# EasyEDA Pro project uChameleon.eprj, board PCB1
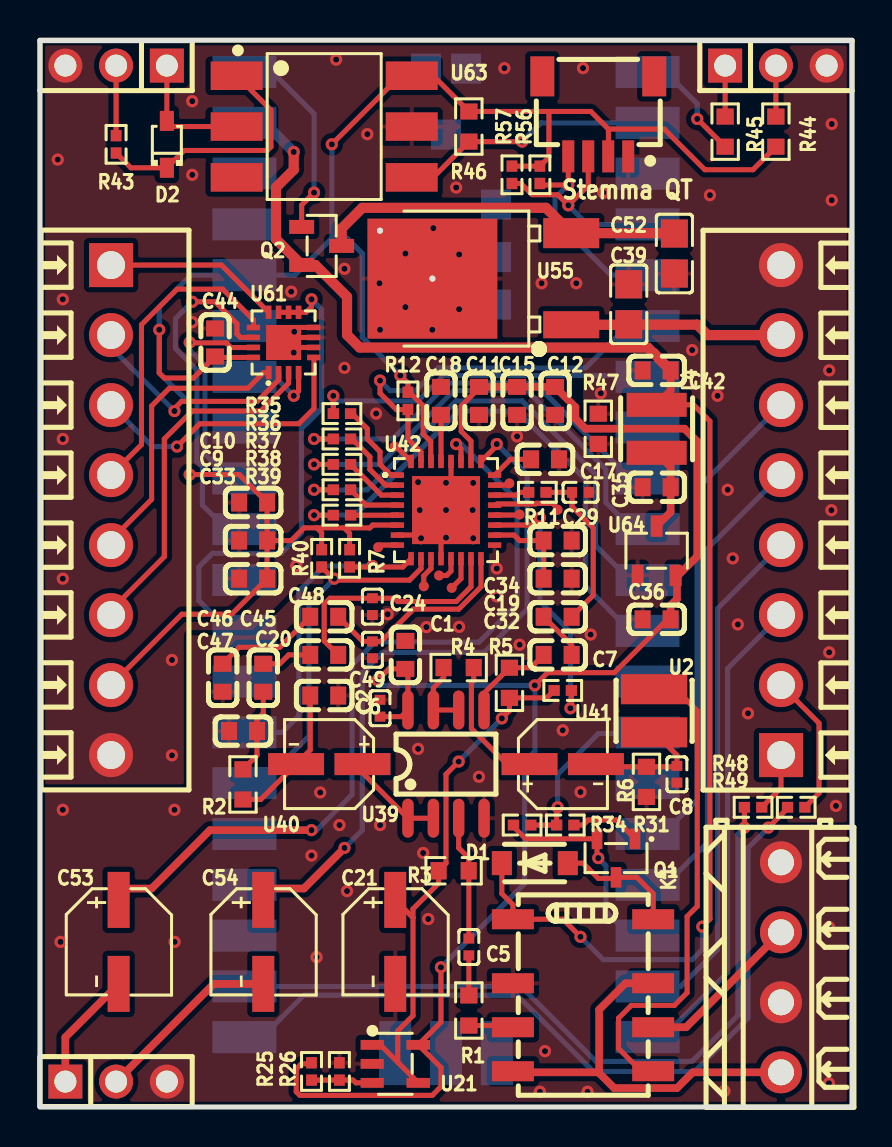
[diagram p3: board, top side]
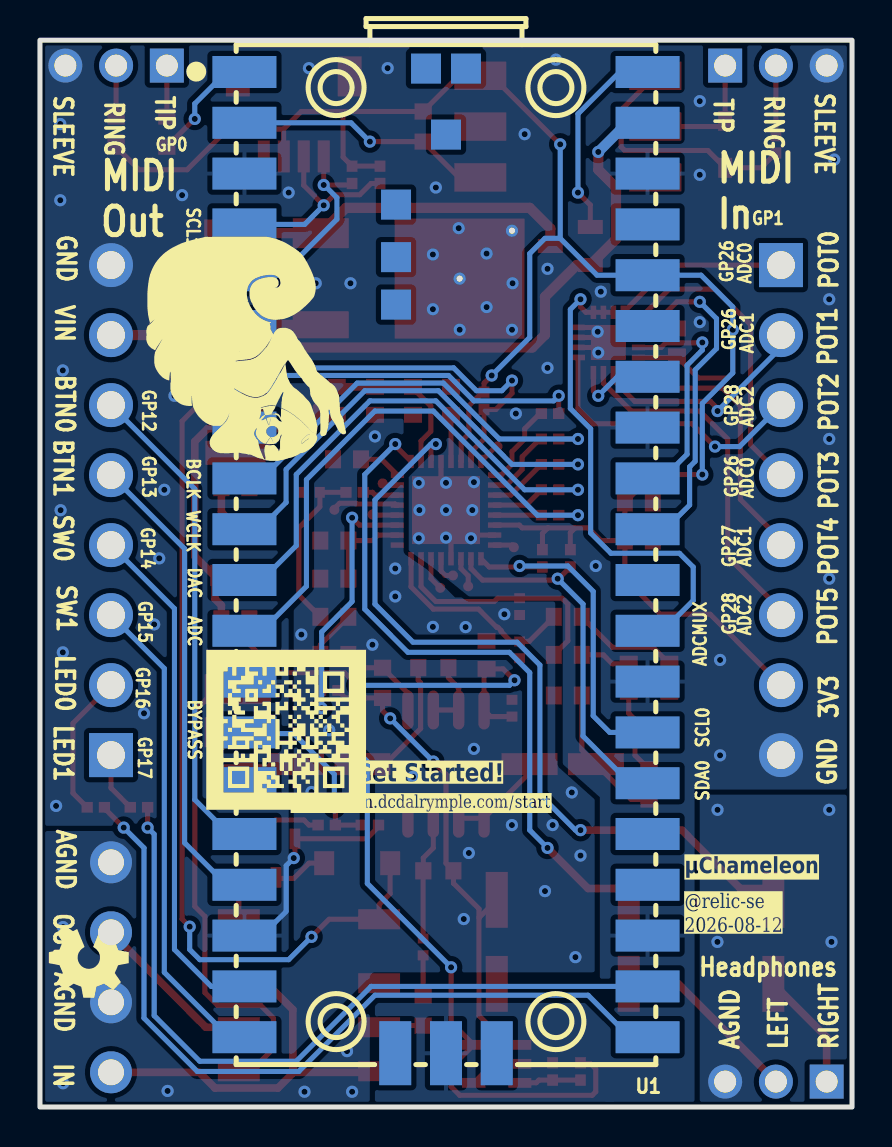
[diagram p4: board, bottom side, seen from below]

Outline 40.64 x 53.34 mm; copper layers: Top Layer, Bottom Layer. Coordinates in mm from the lower left corner of the outline.
Outline path: rectangle 0,53.34 40.64,0
Stack: Top Layer 0.035mm / Dielectric1 1.51mm FR4 er 4.5 / Bottom Layer 0.035mm

## Design rules (mm)
template: Custom Config
spacing copperThickness1oz (default): track to track 0.102, other pairs 0.152 to 0.3
spacing copperThickness2oz: track to track 0.203, other pairs 0.152 to 0.3
track width copperThickness1oz (default): min 0.127, default 0.254, max 2.54
track width copperThickness2oz: min 0.203, default 0.254, max 2.54
differential pair differentialPair (default): width min 0.127, default 0.254, max 2.54; gap min 0.152, default 0.152
via viaSize (default): diameter min 0.5, default 0.61, max 10; hole min 0.3, default 0.305, max 6.3
pour e2523 uses copperRegion1
pour e17478 uses copperRegion1

## Placement (name value [footprint] x y rotation side)
C1  1uF  [C0603]  18.29 22.61 270 top
C2  100nF  [C0402]  17.02 19.94 270 top
C5  100nF  [C0402]  21.46 8 270 top
C6  33nF  [C0603]  14.22 20.57 180 top
C7  10uF  [C0603]  25.91 22.61 180 top
C8  100nF  [C0402]  31.88 16.64 90 top
C9  100nF  [C0603]  10.67 28.32 0 top
C10  1uF  [C0603]  10.67 30.23 0 top
C11  100nF  [C0603]  21.97 35.31 90 top
C12  1uF  [C0603]  25.78 35.31 90 top
C15  10uF  [C0603]  23.88 35.31 90 top
C17  10uF  [C0603]  25.27 32.39 180 top
C18  10uF  [C0603]  20.07 35.31 270 top
C19  10uF  [C0603]  25.91 26.42 180 top
C20  100nF  [C0603]  14.22 22.61 180 top
C21  47uF  [CAP-SMD_BD5.0-L5.3-W5.3-LS6.0-FD]  17.78 8.26 270 top
C24  33pF  [C0402]  16.64 25.02 90 top
C29  4.7nF  [C0402]  27.05 30.73 0 top
C32  100nF  [C0603]  25.91 24.51 0 top
C33  10uF  [C0603]  10.67 26.42 0 top
C34  100nF  [C0603]  25.91 28.32 180 top
C35  1uF  [C0603]  30.86 30.99 0 top
C36  1uF  [C0603]  30.86 24.38 0 top
C39  100nF  [C0805]  31.75 42.67 90 top
C42  1uF  [C0603]  30.86 36.83 180 top
C44  1uF  [C0603]  8.76 38.23 270 top
C45  2.2uF  [C0603]  11.18 21.46 90 top
C46  2.2uF  [C0603]  9.14 21.46 90 top
C47  2.2nF  [C0603]  10.16 18.8 0 top
C48  100nF  [C0603]  14.22 24.51 180 top
C49  33pF  [C0402]  16.64 22.86 90 top
C52  330nF  [C0805]  29.46 40.13 270 top
C53  47uF  [CAP-SMD_BD5.0-L5.3-W5.3-LS6.0-FD]  3.94 8.26 270 top
C54  47uF  [CAP-SMD_BD5.0-L5.3-W5.3-LS6.0-FD]  11.18 8.26 270 top
CN1  Stemma QT  [CONN-SMD_4P-P1.00_XY-SM04B-SRSS-TB]  27.94 49.53 180 top
D1  SM4007PL  [SOD-123F_L2.8-W1.8-LS3.7-RD]  24.76 12.19 0 top
D2  1N4148WS  [SOD-323_L1.8-W1.3-LS2.5-RD]  6.35 48.13 90 top
H1  HP  [HDR-TH_3P-P2.54-V-M]  3.81 1.27 0 top
H2  MIDI_IN  [HDR-TH_3P-P2.54-V-M]  3.81 52.07 180 top
H3  MIDI_OUT  [HDR-TH_3P-P2.54-V-M]  36.83 52.07 0 top
K1  G6K-2F-Y-TR DC5  [RELAY-SMD_G6K-2F-X-XX]  27.18 5.59 270 top
L4  33uH  [IND-SMD_L3.1-W3.1]  30.86 33.91 270 top
NOREF  -  [Pad_e3856]  19.64 41.42 0 top
NOREF#2  -  [Pad_e3858]  17.02 43.82 0 top
Q1  SS8050(RANGE:200-350)  [SOT-23-3_L3.0-W1.3-P1.90-LS2.5-BR]  28.83 12.45 90 top
Q2  AO3401A  [SOT-23-3_L2.9-W1.3-P0.95-LS2.4-BR-1]  14.1 43.05 180 top
R1  10kΩ  [R0603]  21.46 4.83 90 top
R2  100Ω  [R0603]  10.16 16.13 90 top
R3  2MΩ  [R0603]  20.7 11.81 0 top
R4  100Ω  [R0603]  20.95 21.97 0 top
R5  2MΩ  [R0603]  23.5 21.21 90 top
R6  2MΩ  [R0603]  30.35 16.26 90 top
R7  2.2kΩ  [R0402]  15.49 27.43 270 top
R11  1kΩ  [R0402]  24.89 30.73 0 top
R12  100kΩ  [R0402]  18.41 35.31 270 top
R25  100kΩ  [R0402]  13.59 1.78 270 top
R26  100kΩ  [R0402]  14.99 1.78 270 top
R31  1kΩ  [R0402]  26.29 14.1 0 top
R34  100kΩ  [R0402]  24.13 14.1 0 top
R35  10Ω  [R0402]  15.11 34.67 0 top
R36  10Ω  [R0402]  15.11 33.4 0 top
R37  10Ω  [R0402]  15.11 32.13 0 top
R38  10Ω  [R0402]  15.11 30.86 0 top
R39  10Ω  [R0402]  15.11 29.59 0 top
R40  2.2kΩ  [R0402]  14.1 27.43 90 top
R43  200Ω  [R0402]  3.81 48.13 270 top
R44  33Ω  [R0603]  36.83 48.77 270 top
R45  10Ω  [R0603]  34.29 48.77 270 top
R46  4.7kΩ  [R0603]  21.46 49.02 270 top
R47  0Ω  [R0603]  27.94 33.91 270 top
R48  220Ω  [R0402]  35.69 14.99 0 top
R49  220Ω  [R0402]  37.85 14.99 0 top
R53  DNP  [R0402]  26.16 20.83 180 top
R56  2.2kΩ  [R0402]  25.02 46.61 270 top
R57  2.2kΩ  [R0402]  23.62 46.61 270 top
TP2  -  [Test-Point-0.5mm]  19.21 26.04 0 top
TP3  -  [Test-Point-0.5mm]  17.74 33.03 0 top
TP6  -  [Test-Point-0.5mm]  25.91 29.86 0 top
TP7  -  [Test-Point-0.5mm]  24 29.62 0 top
TP9  -  [Test-Point-0.5mm]  16.92 27.99 0 top
TP10  -  [Test-Point-0.5mm]  19.97 26.58 0 top
TP11  -  [Test-Point-0.5mm]  20.61 25.96 0 top
TP12  -  [Test-Point-0.5mm]  23.49 31.18 0 top
U1  Raspberry Pi Pico 2  [COMM-SMD_L51.0-W21.0-P2.54_SC0916]  20.32 27.31 270 bottom
U2  47uH  [IND-SMD_L3.0-W3.0-HPC3015TF-2R2M]  30.73 19.81 270 top
U21  TLV9061IDBVR  [SOT-23-5_L3.0-W1.7-P0.95-LS2.8-BL]  17.78 2.16 270 top
U39  TLV9062IDR  [SOIC-8_L5.0-W4.0-P1.27-LS6.0-BL]  20.32 17.15 0 top
U40  10uF  [CAP-SMD_BD4.0-L4.3-W4.3-LS5.0-FD]  14.48 17.15 180 top
U41  10uF  [CAP-SMD_BD4.0-L4.3-W4.3-LS5.0-FD]  26.16 17.15 0 top
U42  TLV320AIC3204IRHBR  [QFN-32_L5.0-W5.0-P0.50-TL-EP3.4]  20.32 29.85 0 top
U55  L78M05ABDT-TR  [TO-252-2_L6.5-W6.1-P4.58-LS10.0-TL]  23.11 41.4 180 top
U59  INST  [CONN-TH_DB125-3.5-4P-GN]  37.08 6.99 90 top
U60  CTRLS  [CONN-TH_8P-P3.50_DORABO_DB125-3.5-8P-GN-S]  37.08 29.85 90 top
U61  CD4053ALQ/TR  [QFN-16_L3.0-W3.0-P0.50-TL-EP1.7-A]  12.19 38.23 90 top
U62  POTS  [CONN-TH_8P-P3.50_DORABO_DB125-3.5-8P-GN-S]  3.56 29.85 270 top
U63  H11L1S(TA)  [SMD-6_L7.3-W6.5-P2.54-LS10.2-BL]  14.22 49.02 270 top
U64  XC6206P332MR-G  [SOT-23-3_L2.9-W1.6-P1.90-LS2.8-BR]  30.86 27.81 270 top

## Footprints (pads in the part's own frame, mm; a bottom-side part is the same pattern mirrored in y, then rotated)
C0402
  rect 0.5x0.54 smd: 1(-0.42,0) 2(0.42,0)
C0603
  rect 0.8x0.9 smd: 1(-0.7,0) 2(0.7,0)
C0805
  rect 1.41x1.35 smd: 1(-1,0) 2(1,0)
CAP-SMD_BD4.0-L4.3-W4.3-LS5.0-FD
  rect 2.8x1.1 smd: 1(-1.661,0) 2(1.661,0)
CAP-SMD_BD5.0-L5.3-W5.3-LS6.0-FD
  rect 2.8x1.1 smd: 1(-2.1,0) 2(2.1,0)
COMM-SMD_L51.0-W21.0-P2.54_SC0916
  rect 1.6x3.2 smd: 1(-24.445,-10.088) 2(-21.905,-10.088) 3(-19.365,-10.088) 4(-16.825,-10.088) 5(-14.285,-10.088) 6(-11.745,-10.088) 7(-9.205,-10.088) 8(-6.665,-10.088) 9(-4.125,-10.088) 10(-1.585,-10.088) 11(0.955,-10.088) 12(3.495,-10.088) 13(6.035,-10.088) 14(8.575,-10.088) 15(11.115,-10.088) 16(13.655,-10.088) 17(16.195,-10.088) 18(18.735,-10.088) 19(21.275,-10.088) 20(23.815,-10.088) 21(23.815,10.088) 22(21.275,10.088) 23(18.735,10.088) 24(16.195,10.088) 25(13.655,10.088) 26(11.115,10.088) 27(8.575,10.088) 28(6.035,10.088) 29(3.495,10.088) 30(0.955,10.088) 31(-1.585,10.088) 32(-4.125,10.088) 33(-6.665,10.088) 34(-9.205,10.088) 35(-11.745,10.088) 36(-14.285,10.088) 37(-16.825,10.088) 38(-19.365,10.088) 39(-21.905,10.088) 40(-24.445,10.088)
  rect 3.2x1.6 smd: 41(24.615,-2.54) 42(24.615,0) 43(24.615,2.54)
  rect 1.5x1.5 smd: TP1(-21.315,0) TP2(-24.615,1) TP3(-24.615,-1) TP4(-17.815,-2.5) TP5(-15.188,-2.5) TP6(-12.815,-2.5)
CONN-SMD_4P-P1.00_XY-SM04B-SRSS-TB
  rect 0.6x1.6 smd: 1(-1.5,2) 2(-0.5,2) 3(0.5,2) 4(1.5,2)
  rect 1.2x2 smd: 5(2.8,-2) 6(-2.8,-2)
CONN-TH_8P-P3.50_DORABO_DB125-3.5-8P-GN-S
  rect 2.2x2.2 hole 1.4: 1(-12.25,0)
  round 2.2 hole 1.4: 2(-8.75,0) 3(-5.25,0) 4(-1.75,0) 5(1.75,0) 6(5.25,0) 7(8.75,0) 8(12.25,0)
CONN-TH_DB125-3.5-4P-GN
  round 2.1 hole 1.3: 1(-5.25,0) 2(-1.75,0) 3(1.75,0) 4(5.25,0)
HDR-TH_3P-P2.54-V-M
  rect 1.7x1.7 hole 1.1: 1(-2.54,0)
  round 1.7 hole 1.1: 2(0,0) 3(2.54,0)
IND-SMD_L3.0-W3.0-HPC3015TF-2R2M
  rect 1.5x3.32 smd: 1(1.078,0) 2(-1.078,0)
IND-SMD_L3.1-W3.1
  rect 1.2x3 smd: 1(-1.2,0) 2(1.2,0)
Pad_e3856
  round 0.61 hole 0.305: 1(0,0)
Pad_e3858
  round 0.61 hole 0.305: 1(0,0)
QFN-16_L3.0-W3.0-P0.50-TL-EP1.7-A
  rect 0.665x0.28 smd: 1(-1.508,0.75) 2(-1.508,0.25) 3(-1.508,-0.25) 4(-1.508,-0.75) 9(1.508,-0.75) 10(1.508,-0.25) 11(1.508,0.25) 12(1.508,0.75)
  rect 0.28x0.665 smd: 5(-0.75,-1.508) 6(-0.25,-1.508) 7(0.25,-1.508) 8(0.75,-1.508) 13(0.75,1.508) 14(0.25,1.508) 15(-0.25,1.508) 16(-0.75,1.508)
  rect 1.75x1.75 smd: 17(0,0)
QFN-32_L5.0-W5.0-P0.50-TL-EP3.4
  rect 0.665x0.28 smd: 1(-2.433,1.75) 2(-2.433,1.25) 3(-2.433,0.75) 4(-2.433,0.25) 5(-2.433,-0.25) 6(-2.433,-0.75) 7(-2.433,-1.25) 8(-2.433,-1.75) 17(2.433,-1.75) 18(2.433,-1.25) 19(2.433,-0.75) 20(2.433,-0.25) 21(2.433,0.25) 22(2.433,0.75) 23(2.433,1.25) 24(2.433,1.75)
  rect 0.28x0.665 smd: 9(-1.75,-2.433) 10(-1.25,-2.433) 11(-0.75,-2.433) 12(-0.25,-2.433) 13(0.25,-2.433) 14(0.75,-2.433) 15(1.25,-2.433) 16(1.75,-2.433) 25(1.75,2.433) 26(1.25,2.433) 27(0.75,2.433) 28(0.25,2.433) 29(-0.25,2.433) 30(-0.75,2.433) 31(-1.25,2.433) 32(-1.75,2.433)
  rect 3.4x3.4 smd: 33(0,0)
R0402
  rect 0.566x0.54 smd: 1(-0.433,0) 2(0.433,0)
R0603
  rect 0.806x0.864 smd: 1(-0.753,0) 2(0.753,0)
RELAY-SMD_G6K-2F-X-XX
  rect 1x2.1 smd: 1(-3.8,-3.51) 2(-0.6,-3.51) 3(1.6,-3.51) 4(3.8,-3.51) 5(3.8,3.51) 6(1.6,3.51) 7(-0.6,3.51) 8(-3.8,3.51)
SMD-6_L7.3-W6.5-P2.54-LS10.2-BL
  rect 1.423x2.6 smd: 1(-2.54,-4.38) 2(0,-4.38) 3(2.54,-4.38) 4(2.54,4.38) 5(0,4.38) 6(-2.54,4.38)
SOD-123F_L2.8-W1.8-LS3.7-RD
  rect 1x1.2 smd: 1(-1.65,0) 2(1.65,0)
SOD-323_L1.8-W1.3-LS2.5-RD
  rect 1x0.7 smd: 1(-1.173,0) 2(1.173,0)
SOIC-8_L5.0-W4.0-P1.27-LS6.0-BL
  oval 0.569x1.95 smd: 1(-1.905,-2.705) 2(-0.635,-2.705) 3(0.635,-2.705) 4(1.905,-2.705) 5(1.905,2.705) 6(0.635,2.705) 7(-0.635,2.705) 8(-1.905,2.705)
SOT-23-3_L2.9-W1.3-P0.95-LS2.4-BR-1
  rect 1.25x0.7 smd: 1(1,-0.95) 2(1,0.95) 3(-1,0)
SOT-23-3_L2.9-W1.6-P1.90-LS2.8-BR
  rect 1.07x0.6 smd: 1(1.235,-0.95) 2(1.235,0.95) 3(-1.235,0)
SOT-23-3_L3.0-W1.3-P1.90-LS2.5-BR
  rect 1.028x0.532 smd: 1(0.964,-0.95) 2(0.964,0.95) 3(-0.964,0)
SOT-23-5_L3.0-W1.7-P0.95-LS2.8-BL
  rect 0.49x1.157 smd: 1(-0.95,-1.153) 2(0,-1.153) 3(0.95,-1.153)
  rect 0.49x1.175 smd: 4(0.95,1.153) 5(-0.95,1.153)
Test-Point-0.5mm
  round 0.5 smd: 1(0,0)
TO-252-2_L6.5-W6.1-P4.58-LS10.0-TL
  rect 2.8x1.35 smd: 1(-3.475,2.29)
  rect 2.8x1.5 smd: 3(-3.475,-2.29)
  rect 6.5x6 smd: 4(3.475,-0.017)

## Nets
As in the schematic, except:
DGND: C9.1 C10.1 C18.1 C33.1 C39.1 C42.2 C44.1 C52.1 CN1.1 H2.3 H3.3 NOREF.1 NOREF#2.1 Q1.2 R34.1 R47.1 U1.3 U1.8 U1.13 U1.18 U1.23 U1.28 U1.33 U1.38 U1.42 U42.7 U42.12 U42.28 U42.33 U55.4 U60.8 U61.6 U61.7 U61.8 U61.17 U62.8 U63.5

Pads without a net: CN1 5 6; U1 15 24 25 30 35 37 41 43 TP1 TP2 TP3 TP4 TP5 TP6; U63 3

## Via types
v1: diameter 0.61, hole 0.305, Top Layer to Bottom Layer, 126 vias

## Routing (per net, layer and track width the routed paths; a pad name or vN(x,y) marks a point on that pad's centre or on a via; arc(x,y) is an arc through that point)
+3.3VA: length 80.1
  Top Layer w0.254: U42.26 21.57,33.29 21.08,33.78 21.08,35.05 21.97,35.94 21.97,36.01 ; C2.2 18.08,19.52 U39.8 18.41,21.78 C1.2 17.46,21.91 v1(16.89,21.34) ; C36.2 31.41,24.38 28.74,21.72 25.4,21.72 v1(24.76,21.08) ; R25.1 13.54,2.16 13.08,2.16 12.83,1.91 12.83,0.76 13.01,0.58 19.63,0.58 20.07,1.02 20.07,1.98 U21.5 20.07,4.24 v1(20.07,6.99)
  Top Layer w0.381: 31.88,26.52 31.88,25.4 31.56,25.08 C36.2 ; 31.88,26.52 31.81,26.59 ; 31.88,26.52 32.89,27.54 32.89,33.27 32.25,33.92 27.3,33.92 26.8,34.42 26.8,34.99 25.78,36.01 21.97,36.01
  Bottom Layer w0.254: v1(20.07,6.99) 24.26,11.18 24.26,17.27 24.76,17.78 v1(24.76,21.08) 17.14,21.08 v1(16.89,21.34)
+3.3VD: length 104.2
  Top Layer w0.254: 15.22,28.96 15.49,28.68 R7.1 ; 15.22,28.96 16.51,28.96 16.65,29.1 U42.6 ; 15.22,28.96 13.86,28.96 ; v1(5.97,38.86) 5.97,36.7 6.22,36.45 7.69,36.45 C44.2 8.81,37.48 U61.16 ; 28.45,48.9 31.24,48.9 33.27,46.86 35.68,46.86 R44.2 ; 28.45,48.9 28.45,47.54 CN1.2 ; 28.45,48.9 27.57,49.78 25.47,49.78 ; v1(14.6,48.13) 18.03,51.56 U63.6 19.68,51.56 R46.1 25.47,49.78 ; C9.2 12.57,28.32 13.21,28.96 13.86,28.96 ; C9.2 C10.2 9.97,31.62 v1(7.49,31.62) ; C9.2 C33.2 9.59,24.64 7.1,24.64 U62.7 ; 25.47,49.78 25.47,47.5 25.02,47.04 23.62,47.04 ; v1(18.03,36.58) 18.41,36.2 R12.1 18.5,35.74 19.18,35.06 19.18,33.66 19.56,33.27 19.56,32.29 U42.30 ; R40.2 14.1,28.72 13.86,28.96
  Bottom Layer w0.254: 14.6,43.43 15.37,43.43 16.13,42.67 16.13,38.48 v1(18.03,36.58) ; 14.6,43.43 v1(14.6,48.13) ; 14.6,43.43 12.76,41.59 U1.36 7.55,41.59 5.97,40.01 v1(5.97,38.86) 5.97,36.7 7.49,35.18 v1(7.49,31.62)
+5VD: length 76.6
  Top Layer w0.254: D1.1 23.11,10.67 23.67,10.11 K1.1 26.17,9.39 v1(27.05,8.51) ; v1(33.15,9.02) 33.53,9.4 33.53,34.29 32.71,35.11 L4.1
  Top Layer w0.381: C42.1 31.56,35.81 L4.1
  Top Layer w0.508: C42.1 30.97,37.42 30.97,37.45 30.73,37.69 30.7,37.69 30.42,37.97 16,37.97 15.37,38.61 15.37,40.51 13.78,42.1 Q2.2 11.81,43.39 11.81,45.97 12.7,46.86 v1(12.7,47.75)
  Bottom Layer w0.254: v1(33.15,9.02) 33.15,7.87 32.64,7.37 28.19,7.37 v1(27.05,8.51)
  Bottom Layer w0.508: v1(12.7,47.75) 11.24,49.21 U1.39
AGND:
  vias: v1(1.03,8.26) v1(1.14,14.86) v1(6.73,14.86) v1(6.74,8.26) v1(13.59,12.57) v1(13.84,7.49) v1(14.02,15.73) v1(14.99,14.1) v1(15.37,10.8) v1(17.02,14.1) v1(17.4,24.64) v1(18.92,17.91) v1(19.18,12.7) v1(19.34,24) v1(19.43,9.4) v1(20.98,24.01) v1(21.97,16.51) v1(22.86,26.92) v1(22.86,25.53) v1(23.88,33.53) v1(24,23.11) v1(25.02,0.76) v1(25.27,2.79) v1(26.16,18.84) v1(27.05,15.75) v1(27.4,0.76) v1(27.56,23.62) v1(34.25,0.8) v1(39.48,9) v1(39.48,1.19)
DGND: length 23.3
  Top Layer w0.254: R34.1 23.7,14.02 24.3,13.41 Q1.2 27.88,12.51 v1(27.94,12.45) ; 20.07,29.6 19.07,28.6 U42.7 ; 20.07,29.6 v1(20.32,29.85) 20.57,30.1 U42.28 ; 20.07,29.6 U42.12 ; U61.7 12.44,38.48 ; 12.44,38.48 12.94,38.98 U61.8 ; 12.44,38.48 U61.17 12.44,37.98 U61.6
  Bottom Layer w0.254: v1(27.94,12.45) 28.32,12.07 28.32,9.78 29.53,8.57 U1.18
  vias: v1(0.89,47.37) v1(1.14,40.39) v1(1.14,33.4) v1(1.14,26.42) v1(6.6,22.35) v1(6.6,17.58) v1(7.62,50.29) v1(7.62,46.61) v1(7.62,39.24) v1(12.57,40.77) v1(12.73,38.76) v1(12.7,37.72) v1(12.83,27.05) v1(14.82,52.37) v1(15.24,41.91) v1(15.24,36.96) v1(16.38,48.64) v1(16.82,34.67) v1(16.99,41.19) v1(17.02,38.86) v1(18.29,42.67) v1(18.29,39.99) v1(18.92,31.24) v1(19,29.85) v1(19.07,28.44) v1(19.63,38.86) v1(19.69,43.94) v1(20.32,31.21) v1(20.32,28.47) v1(20.83,45.97) v1(20.98,42.63) v1(20.98,39.89) v1(21.65,29.85) v1(21.68,31.21) v1(21.68,28.44) v1(23.24,51.94) v1(25.1,41.19) v1(26.84,41.19) v1(27.18,51.94) v1(28.07,35.69) v1(28.19,45.72) v1(32.64,37.85) v1(33.53,45.59) v1(33.91,35.56) v1(34.42,30.86) v1(34.67,27.43) v1(34.92,24.13) v1(35.43,19.69) v1(39.5,36.83) v1(39.5,22.73) v1(39.62,49.15) v1(39.62,45.34) v1(39.61,29.84) v1(39.83,15.05)
VBAT: length 18.5
  Top Layer w0.508: Q2.3 15.1,43.93 16.13,44.96 25.32,44.96 U55.3 31.73,43.69 C39.2
VBUS: length 10.3
  Top Layer w0.254: v1(13.72,45.72) 13.1,45.1 Q2.1
  Bottom Layer w0.254: U1.40 11.62,51.75 13.72,49.66 v1(13.72,45.72)
VIN: length 10.7
  Top Layer w0.508: 26.59,39.11 29.44,39.11 C52.2 29.48,39.12 32.89,39.12 33.41,38.6 U60.7
ADC0: length 17.8
  Top Layer w0.254: v1(7.62,40.26) 8.76,40.26 9.85,39.17 9.85,38.66 10.03,38.48 10.68,38.48 U61.14
  Bottom Layer w0.254: U1.31 9.34,28.89 8.13,30.1 8.13,32 7.85,32.28 7.85,36.86 6.78,37.92 6.78,39.42 v1(7.62,40.26)
ADC1: length 11.7
  Top Layer w0.254: v1(7.49,38.23) 7.51,38.21 9.33,38.21 9.56,37.97 10.68,37.97 U61.15
  Bottom Layer w0.254: v1(7.49,38.23) 7.49,37.85 8.25,37.08 8.25,32.64 9.46,31.43 U1.32
ADC2: length 4.1
  Top Layer w0.254: U61.4 12.94,35.8 v1(12.7,35.56)
  Bottom Layer w0.254: v1(12.7,35.56) 11.75,36.51 U1.34
BCLK: length 20.8
  Top Layer w0.254: R36.1 v1(13.72,33.4)
  Bottom Layer w0.254: v1(13.72,33.4) 17.65,33.4 20.45,36.2 24.76,36.2 29.53,31.43 U1.9
BIAS: length 27.3
  Top Layer w0.254: U21.4 17.91,2.24 ; 17.91,2.24 17.03,3.11 U21.1 ; 17.91,2.24 17.91,3.81 18.67,4.57 18.67,9.47 ; v1(20.95,17.27) 20.32,16.64 20.32,12.18 R3.1 19.95,11.18 18.67,9.91 18.67,9.47 ; v1(23.11,19.43) 23.5,19.81 R5.1 25.36,20.46 25.73,20.83 ; C21.1 18.67,9.47
  Bottom Layer w0.254: v1(20.95,17.27) v1(23.11,19.43)
BTN0: length 24.7
  Bottom Layer w0.254: U1.16 31.18,13.65 32.89,15.37 32.89,30.9 U60.6
BTN1: length 23.8
  Bottom Layer w0.254: U60.5 33.4,27.91 33.4,13.21 31.3,11.11 U1.17
DIN: length 25.3
  Top Layer w0.254: R38.1 v1(13.72,30.86)
  Bottom Layer w0.254: U1.11 29.53,26.35 27.81,28.07 27.81,31.62 24.13,35.31 20.83,35.31 16.38,30.86 v1(13.72,30.86)
DOUT: length 27.5
  Top Layer w0.254: R39.1 v1(13.72,29.59)
  Bottom Layer w0.254: v1(13.72,29.59) 15.75,29.59 20.95,34.8 23.88,34.8 27.31,31.37 27.31,26.04 29.53,23.81 U1.12
HPL: length 33.7
  Top Layer w0.254: v1(22.86,33.15) 22.86,33.07 U42.25
  Top Layer w0.381: v1(15.24,12.95) 13.21,10.93 11.18,10.93
  Bottom Layer w0.254: v1(15.24,12.95) 16.13,13.84 16.13,21.72 17.14,22.73 22.22,22.73 24.38,24.89 24.38,31.62 v1(22.86,33.15)
HPR: length 40
  Top Layer w0.254: v1(20.83,33.15) 21.07,32.91 U42.27
  Top Layer w0.381: 3.94,10.93 3.94,10.92 5.59,10.92 8.51,13.84 v1(13.59,13.84)
  Bottom Layer w0.254: v1(20.83,33.15) 21.08,33.15 23.88,30.35 23.88,25.15 21.97,23.24 16.76,23.24 15.62,22.1 15.62,15.62 13.84,13.84 v1(13.59,13.84)
IN1M: length 5.4
  Top Layer w0.254: C48.2 12,22.99 9.97,22.99 C46.2
IN1P: length 2.5
  Top Layer w0.254: C45.2 12,22.16 12.45,22.61 C20.2
INST_IN: length 20.5
  Top Layer w0.381: K1.7 29.3,6.19 27.98,4.87 27.98,1.74 ; U59.1 32.67,1.74 31.88,0.95 28.73,0.95 27.98,1.7 27.98,1.74 ; 27.98,1.74 23.72,1.74 K1.4
INST_OUT: length 8.4
  Top Layer w0.381: K1.6 32.34,3.99 U59.3
LED0: length 7.2
  Top Layer w0.254: R49.2 38.99,15.7 38.99,19.19 U60.2
LED1: length 3
  Top Layer w0.254: R48.2 37.08,15.95 U60.1
MCLK: length 17.3
  Top Layer w0.254: R35.1 v1(14.68,35.56)
  Bottom Layer w0.254: U1.7 30.34,36.58 20.19,36.58 18.92,35.31 14.93,35.31 v1(14.68,35.56)
MICBIAS: length 13.5
  Top Layer w0.254: U42.19 24.65,29.1 v1(25.02,29.46) ; R53.1 26.59,19.99 v1(26.54,19.94)
  Bottom Layer w0.254: v1(25.02,29.46) 25.02,25.27 26.54,23.75 v1(26.54,19.94)
MIDI_IN: length 12.9
  Top Layer w0.254: U63.4 19.68,46.48 R46.2 v1(24.13,48.27)
  Bottom Layer w0.254: U1.2 25.07,49.21 v1(24.13,48.27)
MIDI_OUT: length 5.9
  Top Layer w0.254: R45.2 32.9,49.4 v1(32.89,49.4)
  Bottom Layer w0.254: U1.1 31.31,51.75 32.89,50.17 v1(32.89,49.4)
MUX: length 24.9
  Top Layer w0.254: v1(13.59,40.39) 13.59,40.01 13.32,39.73 U61.9 U61.10 U61.11
  Bottom Layer w0.254: U1.29 10.04,24 9.27,24 7.95,25.33 7.95,27 8.64,27.69 12.06,27.69 13.08,28.7 13.08,33.91 14.1,34.93 14.1,39.88 v1(13.59,40.39)
OUT1P: length 2.5
  Top Layer w0.254: C7.1 26.61,23.11 C32.1
POT0: length 8.9
  Top Layer w0.254: U61.12 9.08,42.1 U62.1
POT1: length 11.4
  Top Layer w0.254: U61.2 11.94,36.35 10.87,35.28 7.09,35.28 6.73,34.93 v1(6.73,34.8)
  Bottom Layer w0.254: v1(6.73,34.8) 3.56,37.97 U62.2
POT2: length 14.4
  Top Layer w0.254: v1(6.86,33.02) 8,34.16 12.95,34.16 13.72,34.93 13.72,37.46 U61.5
  Bottom Layer w0.254: U62.3 5.63,33.02 v1(6.86,33.02)
POT3: length 15.5
  Top Layer w0.254: U62.4 5.08,33.12 5.08,39.12 6.86,40.89 9.14,40.89 10.68,39.35 U61.13
POT4: length 14.3
  Top Layer w0.254: U61.1 11.19,36.72 10.41,35.94 6.48,35.94 5.59,35.05 5.59,30.38 3.56,28.35 U62.5
POT5: length 17.8
  Top Layer w0.254: U62.6 3.56,24.85 6.22,27.52 6.22,33.4 7.62,34.8 11.05,34.8 12.44,36.19 U61.3
PRE_IN: length 2.2
  Top Layer w0.254: K1.3 23.58,4.07 R1.1
PRE_OUT: length 24.6
  Top Layer w0.254: 30.73,20.89 31.81,20.89 32.89,19.81 32.89,10.03 32.38,9.53 32.38,5.72 31.75,5.08 29.59,5.08 28.96,4.45 28.96,2.92 30.09,1.79 K1.5
SCL0: length 16.7
  Top Layer w0.254: R7.2 18.16,27 U42.9
  Bottom Layer w0.254: U1.27 12.13,18.73 12.95,19.56 12.95,25.78 14.22,27.05 v1(16.64,27.05)
SCL1: length 10.7
  Top Layer w0.254: CN1.4 v1(26.44,46.1) 25.09,46.1 R56.2
  Bottom Layer w0.254: v1(26.44,46.1) 26.42,46.1 25.78,45.47 25.78,44.38 28.57,41.59 U1.5
SDA0: length 18.6
  Top Layer w0.254: U42.10 19.07,26.92 18.49,26.34 14.75,26.34 R40.1
  Bottom Layer w0.254: U1.26 11.11,16.19 13.46,18.54 13.46,25.15 v1(14.73,26.42)
SDA1: length 10.5
  Top Layer w0.254: R57.2 24.07,46.18 24.63,45.61 25.91,45.61 v1(26.44,45.09) 27.44,46.09 CN1.3
  Bottom Layer w0.254: U1.4 27.39,44.13 v1(26.44,45.09)
SW0: length 25.8
  Bottom Layer w0.254: U60.4 33.91,24.92 33.91,7.87 32.06,6.03 U1.19
SW1: length 24.3
  Bottom Layer w0.254: U1.20 31.18,3.49 34.42,6.73 34.42,21.93 U60.3
WCLK: length 23
  Top Layer w0.254: R37.1 v1(13.72,32.13)
  Bottom Layer w0.254: v1(13.72,32.13) 17.02,32.13 20.7,35.81 24.38,35.81 28.32,31.88 28.32,30.23 29.66,28.89 U1.10
~BYPASS: length 9.2
  Top Layer w0.254: R34.2 R31.1 25.86,14.93 v1(25.91,14.99)
  Bottom Layer w0.254: U1.14 30.35,18.67 27.94,18.67 25.91,16.64 v1(25.91,14.99)
~RESET: length 20.2
  Top Layer w0.254: U42.31 19.07,32.75 18.41,33.4 R12.2 17.83,34.87 17.02,35.69 v1(17.02,36.32)
  Bottom Layer w0.254: v1(17.02,36.32) 17.53,35.81 18.8,35.81 19.94,36.96 27.31,36.96 29.4,39.05 U1.6
$1N3967: length 40.1
  Top Layer w0.254: 37.41,14.99 37.41,14.93 v1(36.45,13.97)
  Bottom Layer w0.254: v1(36.45,13.97) 35.43,12.95 35.43,4.45 32.77,1.78 27.69,1.78 23.88,5.59 13.21,5.59 11.11,3.49 U1.21
$1N3971: length 37.7
  Top Layer w0.254: R48.1 v1(35.25,13.97)
  Bottom Layer w0.254: v1(35.25,13.97) 34.92,13.64 34.92,4.57 32.64,2.29 27.81,2.29 24.07,6.03 U1.22
$1N5594: length 12.8
  Top Layer w0.254: R43.2 4.55,46.96 D2.1 7.22,47.83 11.38,47.83 11.56,48.01 11.56,49.85 U63.1
$1N5598: length 6.4
  Top Layer w0.254: H2.1 D2.2 6.63,49.02 U63.2
$1N5687: length 3.5
  Top Layer w0.254: 3.81,48.57 H2.2
$1N5881: length 2.5
  Top Layer w0.254: R44.1 H3.2
$1N5979: length 2.5
  Top Layer w0.254: R45.1 H3.1
$1N10835: length 4.2
  Top Layer w0.381: L4.2 31.56,32.01 C35.2 31.56,29.75 U64.3
$2N3909: length 4.3
  Top Layer w0.254: U42.1 17.55,31.6 17.02,32.13 17.02,32.77 16.38,33.4 16.38,33.91 15.62,34.67 R35.2
$2N3910: length 3.7
  Top Layer w0.254: R36.2 15.62,33.4 16.51,32.51 16.51,31.88 17.29,31.1 U42.2
$2N3911: length 3
  Top Layer w0.254: R37.2 17.08,30.6 U42.3
$2N3912: length 2.7
  Top Layer w0.254: R38.2 16.31,30.1 U42.4
$2N3913: length 2.3
  Top Layer w0.254: U42.5 17.88,29.59 R39.2
$2N3920: length 2.1
  Top Layer w0.254: U42.24 23.54,32.39 C17.2
$2N3922: length 4.5
  Top Layer w0.254: U42.18 23.73,28.6 24,28.32 C34.2 C19.2
$2N3923: length 2.3
  Top Layer w0.254: U42.29 20.07,34.6 C18.2
$2N3938: length 1.8
  Top Layer w0.254: U42.22 23.86,30.6 24,30.73 R11.1
$2N3939: length 8.4
  Top Layer w0.254: R11.2 C29.1 26.63,30.01 27.69,28.96 27.69,25.59 C32.2
$2N3946: length 1.5
  Top Layer w0.254: U42.11 19.57,26.92 19.21,26.56 TP2.1
$2N3947: length 1.1
  Top Layer w0.254: TP3.1 17.82,33.03 U42.32
$2N3972: length 3.4
  Top Layer w0.254: TP6.1 25.91,29.93 25.65,30.19 24.83,30.19 24.8,30.15 22.88,30.15 22.82,30.1 U42.21
$2N3973: length 1.3
  Top Layer w0.254: TP7.1 23.97,29.6 U42.20
$2N3975: length 1
  Top Layer w0.254: TP9.1 17.03,28.1 U42.8
$2N3976: length 12.1
  Top Layer w0.254: U42.15 21.57,26.02 20.83,25.27 17.91,25.27 17.74,25.44 C24.2 14.52,25.44 14.22,25.15 14.22,23.31 C20.1
$2N3977: length 10.2
  Top Layer w0.254: C48.1 16.16,23.28 C49.2 17.07,23.28 17.56,23.76 17.56,23.82 17.72,23.99 17.78,23.99 18.69,24.89 20.95,24.89 22.07,26.01 U42.16
$2N4226: length 0.8
  Top Layer w0.254: TP12.1 23.41,31.1 U42.23
$2N4249: length 1.6
  Top Layer w0.254: U42.14 21.07,26.42 TP11.1
$2N4315: length 1.3
  Top Layer w0.254: U42.13 20.57,26.79 20.35,26.58 TP10.1
$2N4806: length 6
  Top Layer w0.381: H1.1 1.27,3.49 C53.2
$2N4810: length 9.4
  Top Layer w0.381: C54.2 8.69,6.16 H1.2
$3N1576: length 3.6
  Top Layer w0.254: 29.78,13.41 28.84,14.35 27.43,14.35 27.18,14.1 R31.2
$3N1578: length 6.2
  Top Layer w0.254: D1.2 27.18,12.19 27.94,11.43 28.78,11.43 Q1.3 29.87,11.48 30.69,10.67 K1.8
$3N1581: length 4.9
  Top Layer w0.254: U40.1 16.14,16.72 U39.1 U39.2
$3N1582: length 7.1
  Top Layer w0.254: R2.1 11.05,15.38 U40.2 13.52,17.85 C6.2
$3N1583: length 6.2
  Top Layer w0.254: C5.1 21.46,11.8 R3.2 21.45,12.45 20.95,12.95 U39.3
$3N1584: length 2
  Top Layer w0.254: R1.2 C5.2
$3N1587: length 3.6
  Top Layer w0.254: U39.6 U39.7 19.69,20.96 20.2,21.47 R4.1
$3N1588: length 6.7
  Top Layer w0.254: U41.1 23.37,17.15 21.59,18.92 21.59,21.21 21.71,21.33 R4.2
$3N1589: length 6.3
  Top Layer w0.254: U2.1 31.88,17.59 C8.2 31.83,17.01 R6.2 27.96,17.01 U41.2
$3N1590: length 4.6
  Top Layer w0.254: C7.2 24.56,21.96 R5.2 22.22,20.69 U39.5
$3N1598: length 3.1
  Top Layer w0.254: R25.2 R26.2 15.67,1.35 15.81,1.21 U21.3
$3N2358: length 4.3
  Top Layer w0.254: R2.2 10.86,17.58 C47.2 10.86,19.37 11.18,19.69 C45.1

## Copper pours and planes (outline as drawn; the poured copper is in the pictures)
AGND on Top Layer: 33.18,33.91 33.18,14.06 33.27,13.97 40.73,13.97 40.73,-0.01 0,-0.01 0,15.75 0.13,15.88 7.46,15.88 7.46,23.59 10.76,23.59 12.95,25.78 20.36,25.78 20.36,31.17 20.83,31.64 20.83,37.08 26.92,37.08 26.92,34.67 27.69,33.91
AGND on Bottom Layer: 28.19,33.95 22.37,35.35 22.37,27.98 19.87,25.48 14.9,25.48 14.85,25.53 14.85,17.39 12.83,15.37 12.83,6.6 23.75,6.6 23.88,6.48 23.88,0 40.51,0 40.64,-0.13 40.64,13.99 33.33,13.99 33.33,7.37 28.7,7.37 28.19,7.87
AGND on Bottom Layer: 7.75,15.75 0.13,15.75 0,15.88 0,0.02 0.02,0 7.82,0 7.82,15.67
DGND on Top Layer: 0,53.34 40.64,53.34 40.64,14.1 40.77,13.97 33.33,13.97 33.33,33.98 33.15,34.16 27.47,34.16 26.93,34.7 26.93,37.08 26.92,37.08 20.57,37.08 20.57,28.06 20.33,27.82 20.33,26.89 19.59,26.14 12.94,26.14 10.61,23.81 7.43,23.81 7.43,15.94 7.49,15.88 7.47,15.86 0.06,15.86 0.06,53.28
DGND on Bottom Layer: 12.06,0 7.88,0 7.88,15.88 0.06,15.88 0.06,53.32 40.62,53.32 40.64,53.34 40.64,14.06 33.49,14.06 33.4,13.97 33.4,7.37 28.19,7.37 28.19,33.91 22.19,35.49 22.19,27.82 21.07,27.05 19.18,25.53 14.48,25.53 14.48,17.15 12.62,15.49 12.62,0.56
DGND on Bottom Layer: 11.87,6.48 23.88,6.48 23.88,0 11.87,0

## Text on the board
Bottom Silkscreen Layer: GP12 | GP13 | GP14 | GP15 | GP17 | GP16 | ADC1 | ADC2 | ADC0 | GP28 | GP26 | GP27 | SDA0 | ADCMUX | GP0 | RST | MCLK | DAC | ADC | BYPASS | SCL1 | SDA1 | BCLK | WCLK | SCL0 | GP1 | SLEEVE | RING | TIP | GND | SW1 | AGND | BTN0 | LED0 | VIN | LED1 | BTN1 | SW0 | OUT | IN | POT0 | POT2 | POT3 | 3V3 | RIGHT | POT4 | POT1 | POT5 | LEFT | Headphones | MIDI / In | MIDI / Out | chameleon.dcdalrymple.com/start | μChameleon | Get Started! | @relic-se / 2026-08-12
Top Silkscreen Layer: Stemma QT
